# EasyEDA Pro project TJMakes_Hub.eprj

# Schematic schematic1
Create Date: 2024-02-23; Page Name: P1; Project Name: TJMakes_Hub; Schematic Name: schematic1; Update Date: 2024-02-26; Company: EasyEDA.com; Drawn: EasyEDA; Page Size: A4; Part Number: JLCPCB-002; Reviewed: EasyEDA; Version: V0.1
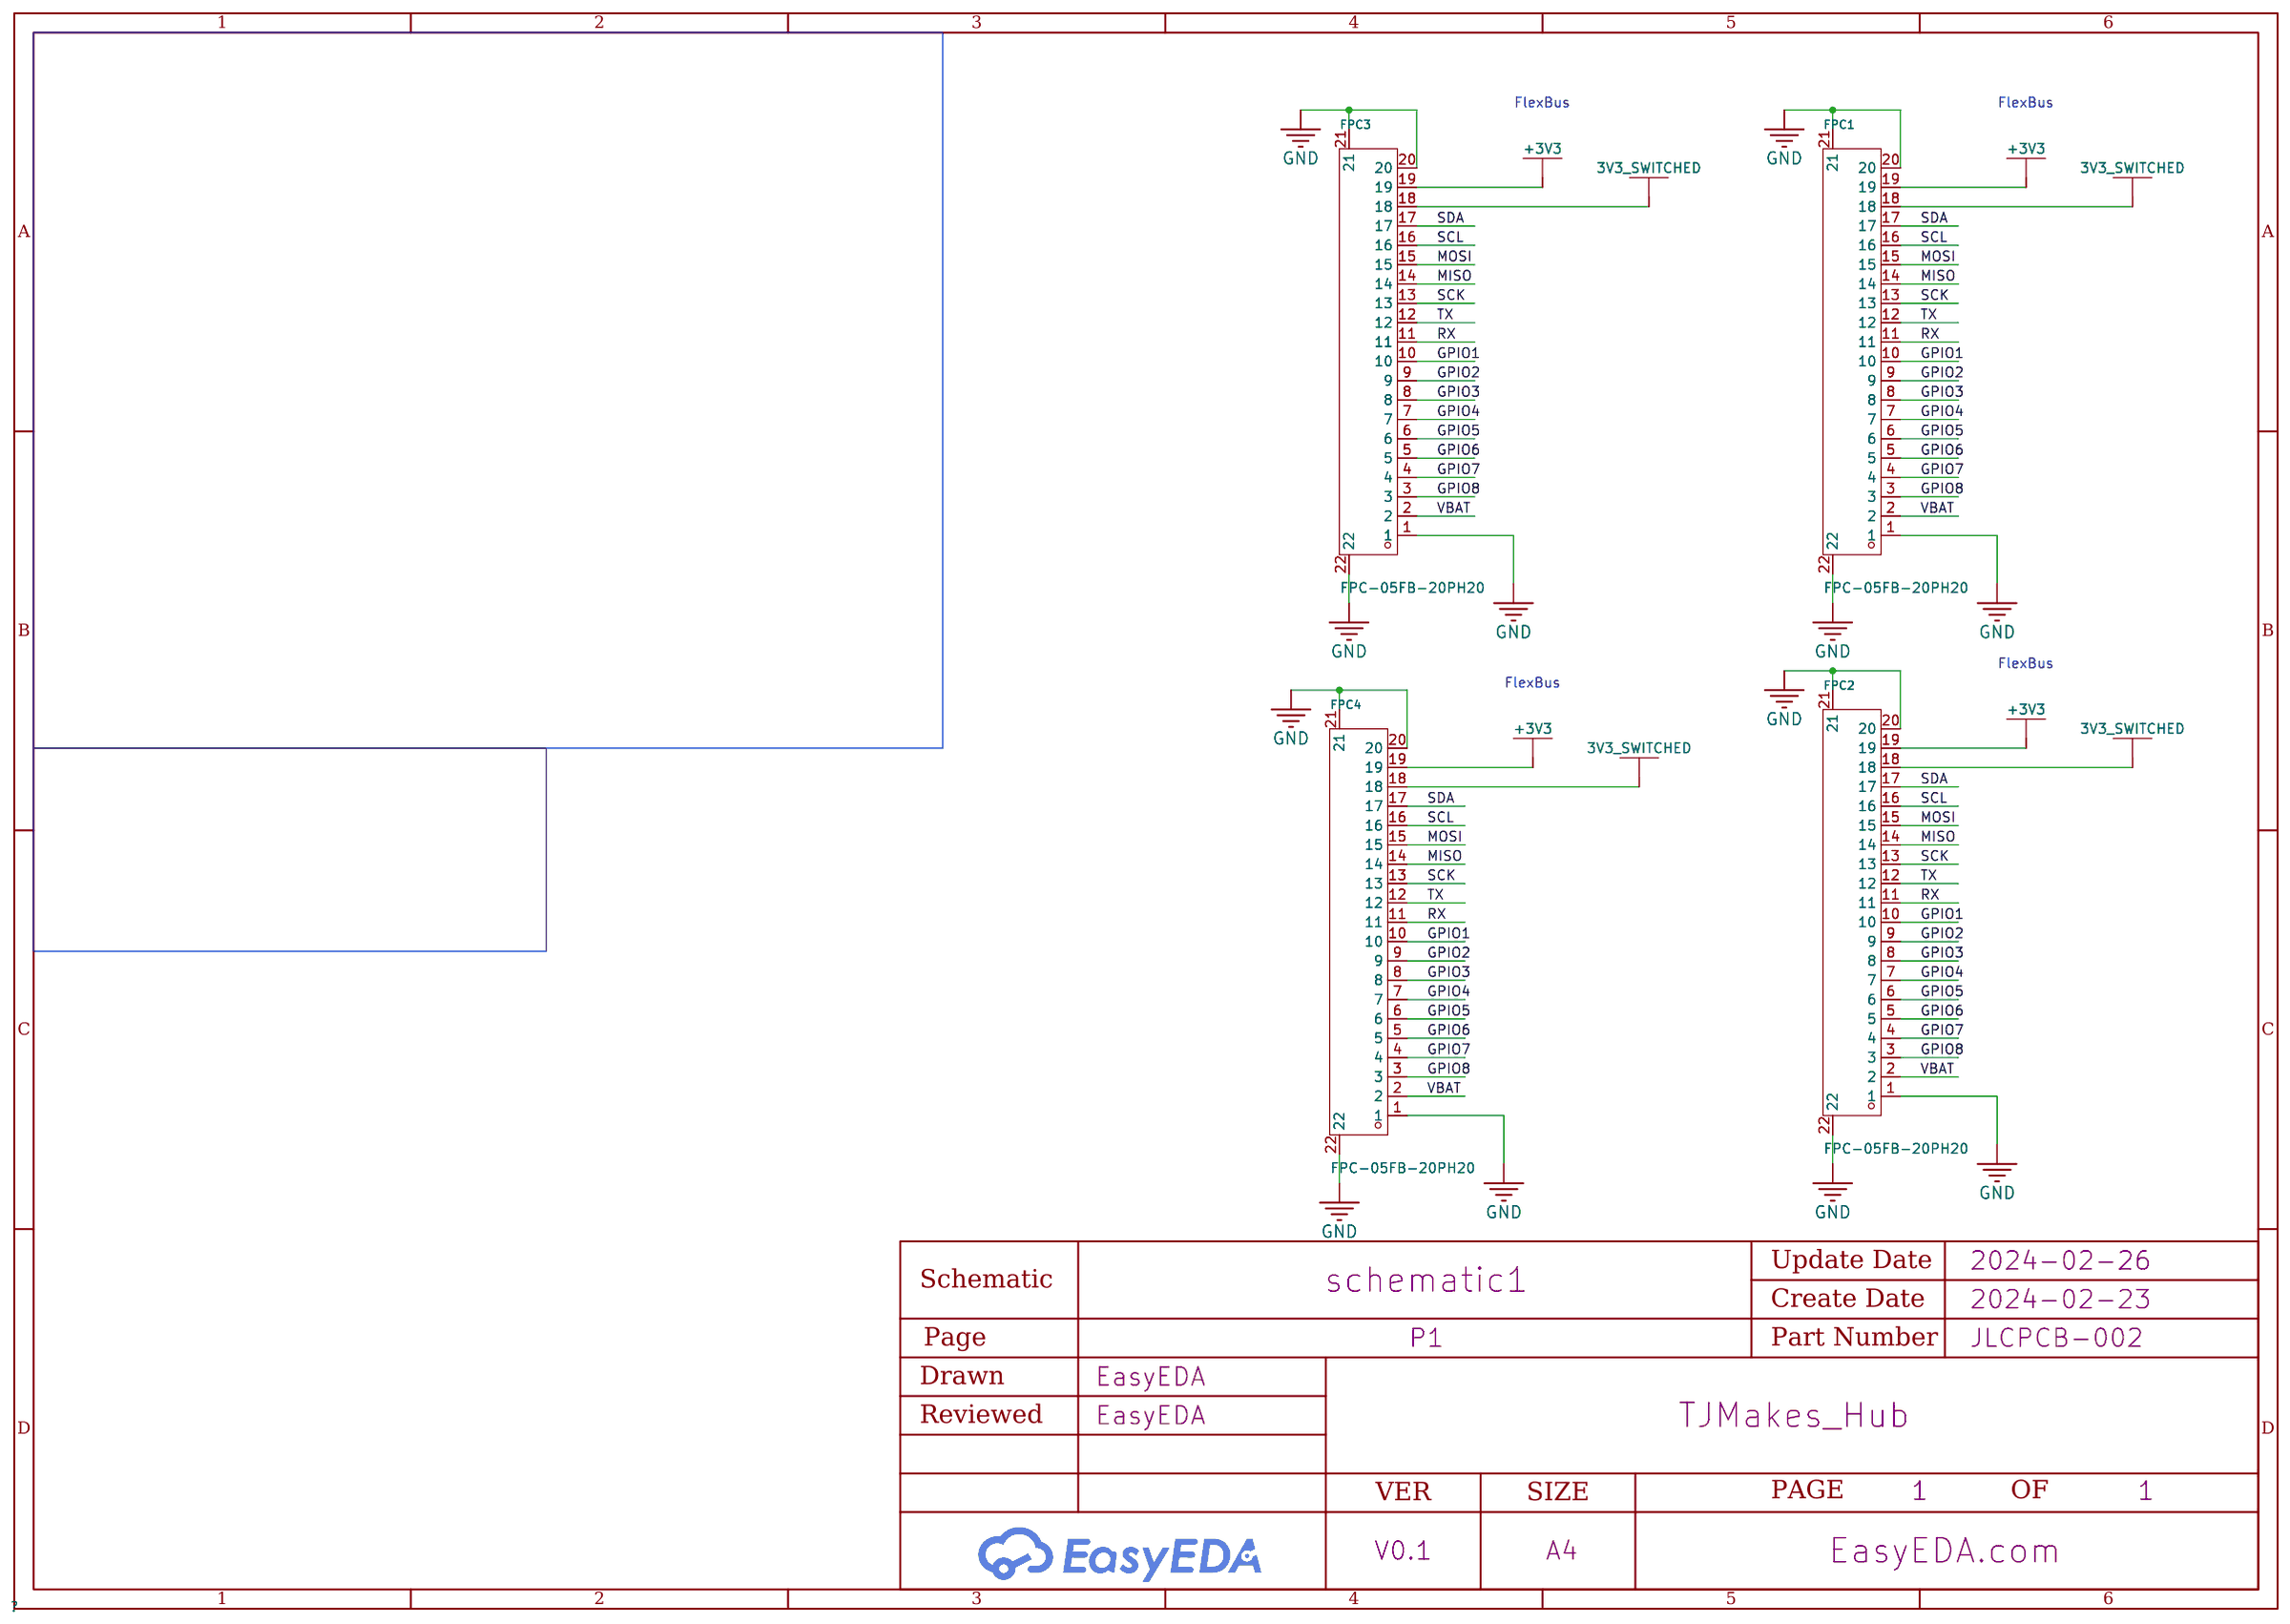
[diagram p0: schematic sheet]

## Parts
FPC1  FPC-05FB-20PH20  [FPC-SMD_20P-P0.50_FPC-05FB-20PH20]
FPC2  FPC-05FB-20PH20  [FPC-SMD_20P-P0.50_FPC-05FB-20PH20]
FPC3  FPC-05FB-20PH20  [FPC-SMD_20P-P0.50_FPC-05FB-20PH20]
FPC4  FPC-05FB-20PH20  [FPC-SMD_20P-P0.50_FPC-05FB-20PH20]

## Library data of the parts
FPC1-FPC4 = FPC-05FB-20PH20: Pitch:0.5mm Number of Contacts:20P Locking Feature:Clamshell FFC, FCB Thickness:0.3mm FFC, FCB Thickness:0.3mm Contact Type:Double-sided contacts/up and down connection Mounting Type:Surface Mount Height Above Board:2mm Operating Temperature Range:-25℃~+8; LCSC Part Name: 间距:0.5mm P数:20P 翻盖式 双侧触点/上下接; Supplier Part: C2856830; Manufacturer: XUNPU(讯普); Supplier Footprint: SMD,P=0.5mm,卧贴; JLCPCB Part Class: Extended Part; Datasheet: https://atta.szlcsc.com/upload/public/pdf/source/20210922/C2856830_32DC95BE77527398880E7D75F765EF2A.pdf; Supplier: LCSC; Pitch: 0.5mm; Number of Contacts: 20P; Locking Feature: Clamshell; FFC, FCB Thickness: 0.3mm; Contact Type: Double-sided contacts/up and down connection; Mounting Type: Surface Mount; Height Above Board: 2mm; Operating Temperature Range: -25℃~+85℃

## Nets
3V3_SWITCHED: FPC1.18 FPC2.18 FPC3.18 FPC4.18
+3V3: FPC1.19 FPC2.19 FPC3.19 FPC4.19
GND: FPC1.1 FPC1.20 FPC1.21 FPC1.22 FPC2.1 FPC2.20 FPC2.21 FPC2.22 FPC3.1 FPC3.20 FPC3.21 FPC3.22 FPC4.1 FPC4.20 FPC4.21 FPC4.22
VBAT: FPC1.2 FPC2.2 FPC3.2 FPC4.2
GPIO1: FPC1.10 FPC2.10 FPC3.10 FPC4.10
GPIO2: FPC1.9 FPC2.9 FPC3.9 FPC4.9
GPIO3: FPC1.8 FPC2.8 FPC3.8 FPC4.8
GPIO4: FPC1.7 FPC2.7 FPC3.7 FPC4.7
GPIO5: FPC1.6 FPC2.6 FPC3.6 FPC4.6
GPIO6: FPC1.5 FPC2.5 FPC3.5 FPC4.5
GPIO7: FPC1.4 FPC2.4 FPC3.4 FPC4.4
GPIO8: FPC1.3 FPC2.3 FPC3.3 FPC4.3
MISO: FPC1.14 FPC2.14 FPC3.14 FPC4.14
MOSI: FPC1.15 FPC2.15 FPC3.15 FPC4.15
RX: FPC1.11 FPC2.11 FPC3.11 FPC4.11
SCK: FPC1.13 FPC2.13 FPC3.13 FPC4.13
SCL: FPC1.16 FPC2.16 FPC3.16 FPC4.16
SDA: FPC1.17 FPC2.17 FPC3.17 FPC4.17
TX: FPC1.12 FPC2.12 FPC3.12 FPC4.12

## Notes on the sheet
- FlexBus
- FlexBus
- FlexBus
- FlexBus

# Board PCB1
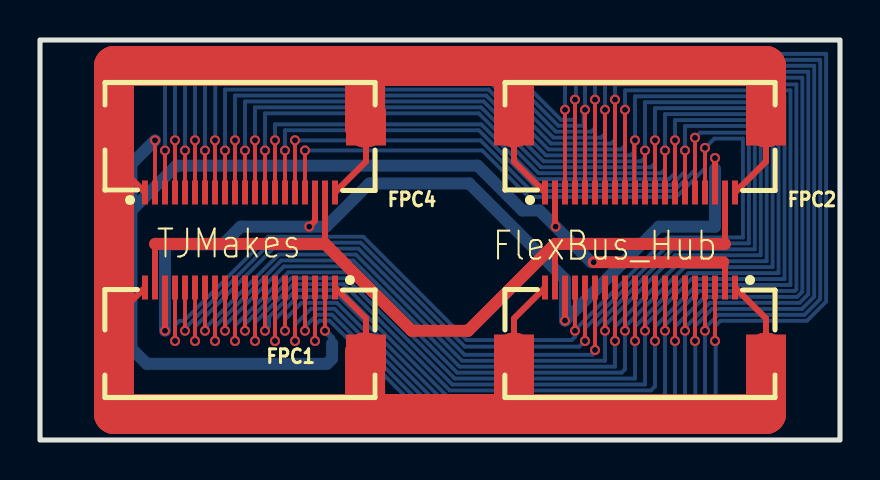
[diagram p1: board, top side]
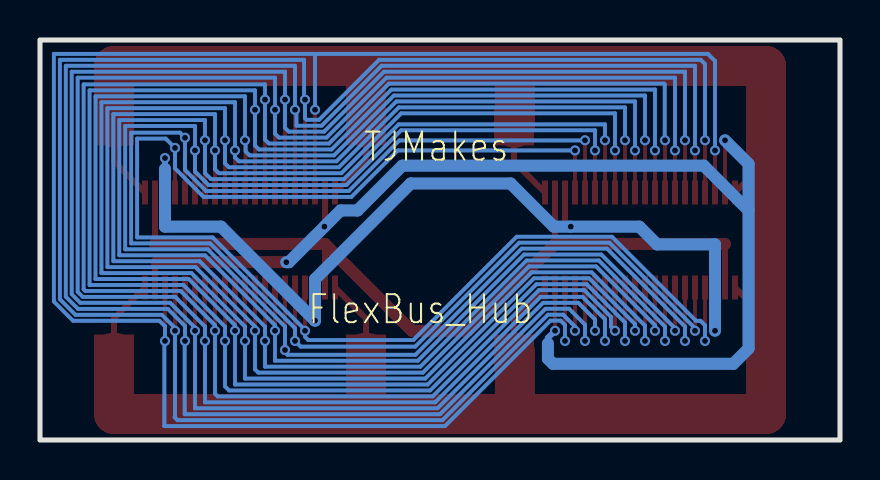
[diagram p2: board, bottom side, seen from below]

Outline 40 x 20 mm; copper layers: Top Layer, Bottom Layer. Coordinates in mm from the lower left corner of the outline.
Outline path: rectangle 0,20 40,0
Stack: Top Layer 0.035mm / Dielectric1 1.51mm FR4 er 4.5 / Bottom Layer 0.035mm

## Design rules (mm)
template: JLCPCB Capability(Two Layers Board)
spacing copperThickness1oz (default): track to track 0.102, other pairs 0.152 to 0.3
spacing copperThickness2oz: track to track 0.203, other pairs 0.152 to 0.3
track width copperThickness1oz (default): min 0.127, default 0.254, max 2.54
track width copperThickness2oz: min 0.203, default 0.254, max 2.54
differential pair differentialPair (default): width min 0.127, default 0.254, max 2.54; gap min 0.152, default 0.152
via viaSize (default): diameter min 0.5, default 0.61, max 10; hole min 0.3, default 0.305, max 6.3

## Placement (name value [footprint] x y rotation side)
FPC1  FPC-05FB-20PH20  [FPC-SMD_20P-P0.50_FPC-05FB-20PH20]  10 6 0 top
FPC2  FPC-05FB-20PH20  [FPC-SMD_20P-P0.50_FPC-05FB-20PH20]  30 14 180 top
FPC3  FPC-05FB-20PH20  [FPC-SMD_20P-P0.50_FPC-05FB-20PH20]  30 6 0 top
FPC4  FPC-05FB-20PH20  [FPC-SMD_20P-P0.50_FPC-05FB-20PH20]  10 14 180 top

## Footprints (pads in the part's own frame, mm; a bottom-side part is the same pattern mirrored in y, then rotated)
FPC-SMD_20P-P0.50_FPC-05FB-20PH20
  rect 0.3x1.2 smd: 1(4.75,1.625) 2(4.25,1.625) 3(3.75,1.625) 4(3.25,1.625) 5(2.75,1.625) 6(2.25,1.625) 7(1.75,1.625) 8(1.25,1.625) 9(0.75,1.625) 10(0.25,1.625) 11(-0.25,1.625) 12(-0.75,1.625) 13(-1.25,1.625) 14(-1.75,1.625) 15(-2.25,1.625) 16(-2.75,1.625) 17(-3.25,1.625) 18(-3.75,1.625) 19(-4.25,1.625) 20(-4.75,1.625)
  rect 2x1.8 smd: 21(-6.3,-1.625) 22(6.3,-1.625)

## Nets
As in the schematic.

## Via types
v1: diameter 0.5, hole 0.3, Top Layer to Bottom Layer, 68 vias

## Routing (per net, layer and track width the routed paths; a pad name or vN(x,y) marks a point on that pad's centre or on a via; arc(x,y) is an arc through that point)
3V3_SWITCHED: length 49.9
  Top Layer w0.3: FPC4.18 13.75,10.96 v1(13.46,10.67) ; v1(26.25,5.97) FPC3.18 ; v1(33.75,14.1) FPC2.18 ; FPC1.18 v1(6.25,5.46)
  Bottom Layer w0.3: v1(33.75,14.1) 33.75,13.56
  Bottom Layer w0.6: v1(6.25,5.46) 6.25,9.78 9.14,9.78 10.03,10.67 v1(13.46,10.67) 14.31,10.67 16.47,12.83 21.46,12.83 26.25,8.04 v1(26.25,5.97) 30.95,10.67 33.75,10.67 33.75,13.56
+3V3: length 41.6
  Top Layer w0.195: 25.75,7.72 25.78,7.75
  Top Layer w0.3: FPC2.19 34.25,9.81 ; FPC1.19 5.75,9.81 ; FPC4.19 14.25,9.81 ; 25.75,9.81 25.75,7.72
  Top Layer w0.6: 34.25,9.81 25.75,9.81 21.41,5.46 18.59,5.46 14.25,9.81 5.75,9.81
GND: length 128.9
  Top Layer w0.3: FPC3.20 23.7,6.08 FPC3.21 ; FPC2.22 23.7,13.92 FPC2.1 ; FPC1.22 16.3,6.08 FPC1.1 ; FPC2.20 36.3,13.92 FPC2.21 ; FPC4.1 3.7,13.92 ; FPC4.21 16.3,13.92 FPC4.20 ; FPC3.1 36.3,6.08 FPC3.22 ; FPC1.20 3.7,6.08
  Top Layer w2: FPC2.22 23.7,18.7 ; 23.7,18.7 36.3,18.7 FPC2.21 ; 23.7,18.7 16.26,18.7 ; 23.7,1.3 16.26,1.3 ; 23.7,1.3 36.3,1.3 FPC3.22 ; 23.7,1.3 FPC3.21 ; 16.26,1.3 16.26,4.38 FPC1.22 ; 16.26,1.3 3.7,1.3 FPC1.21 FPC4.22 3.7,18.7 16.26,18.7 ; 16.26,18.7 16.26,15.62 FPC4.21
VBAT: length 63.2
  Top Layer w0.195: FPC4.2 v1(5.75,14.99) ; FPC1.2 v1(14.25,5.46)
  Top Layer w0.3: 34.16,8.89 34.25,8.8 FPC3.2 ; v1(25.78,10.67) 25.75,10.7 FPC2.2
  Top Layer w0.6: v1(27.69,8.89) 34.16,8.89
  Bottom Layer w0.3: v1(14.25,5.46) 14.6,5.11 14.6,4.83
  Bottom Layer w0.6: 14.6,4.83 14.6,4.06 14.35,3.81 5.33,3.81 4.57,4.57 4.57,11.48 ; 4.57,11.48 4.57,13.81 v1(5.75,14.99) ; 4.57,11.48 6.81,13.72 21.88,13.72 24.12,11.48 24.97,11.48 v1(25.78,10.67) 27.56,8.89 v1(27.69,8.89)
GPIO1: length 86.8
  Top Layer w0.195: FPC1.10 v1(10.25,5.46) ; FPC2.10 29.72,12.41 29.72,14.99 ; FPC4.10 v1(9.75,14.99) ; FPC3.10 v1(30.25,5.46)
  Bottom Layer w0.195: v1(9.75,14.99) 9.75,17.23 22.31,17.23 25.3,14.23 29.52,14.23 29.72,14.43 29.72,14.99 ; v1(10.25,5.46) 10.25,5.8 12.54,8.09 15.3,8.09 20.61,2.77 30.25,2.77 v1(30.25,5.46) 30.25,5.74 32.56,8.05 37.22,8.05 37.22,17.19 29.75,17.19 v1(29.75,14.99)
GPIO2: length 91.4
  Top Layer w0.195: FPC1.9 v1(10.75,4.95) ; FPC3.9 v1(30.75,4.95) ; FPC2.9 v1(29.25,16.51) ; FPC4.9 v1(9.25,14.48)
  Bottom Layer w0.195: v1(10.75,4.95) 10.75,5.88 12.66,7.79 15.18,7.79 20.49,2.48 30.54,2.48 30.75,2.68 v1(30.75,4.95) 30.75,5.67 32.83,7.75 37.52,7.75 37.52,17.48 29.25,17.48 v1(29.25,16.51) 29.25,14.72 29.06,14.53 25.42,14.53 22.43,17.52 9.25,17.52 v1(9.25,14.48) 9.27,14.48
GPIO3: length 91.9
  Top Layer w0.195: FPC3.8 v1(31.25,5.46) ; FPC2.8 v1(28.75,17.02) ; FPC4.8 v1(8.75,14.99) ; FPC1.8 v1(11.25,5.46)
  Bottom Layer w0.195: v1(31.25,5.46) 31.25,5.74 32.97,7.45 37.74,7.45 37.82,7.53 37.82,17.78 28.75,17.78 v1(28.75,17.02) 28.75,15.02 28.56,14.82 25.55,14.82 22.55,17.82 8.8,17.82 8.76,17.78 8.76,15 v1(8.75,14.99) ; v1(31.25,5.46) 31.24,5.46 ; v1(31.25,5.46) 31.25,2.31 31.12,2.18 20.37,2.18 15.05,7.49 12.79,7.49 11.45,6.16 11.45,5.66 v1(11.25,5.46)
GPIO4: length 94.5
  Top Layer w0.195: FPC2.7 v1(28.25,16.51) ; FPC1.7 v1(11.75,4.95) ; FPC4.7 v1(8.25,14.48) ; FPC3.7 v1(31.75,4.95)
  Bottom Layer w0.195: 8.25,14.48 v1(8.25,14.48) 8.25,18.12 22.68,18.12 25.67,15.12 28.06,15.12 28.25,15.32 v1(28.25,16.51) 28.25,18.12 38.12,18.12 38.12,7.41 37.86,7.16 33.24,7.16 31.75,5.67 v1(31.75,4.95) 31.75,1.88 20.24,1.88 14.97,7.16 12.87,7.16 11.75,6.03 v1(11.75,4.95)
GPIO5: length 94.9
  Top Layer w0.195: FPC1.6 v1(12.25,5.46) ; FPC2.6 v1(27.75,17.02) ; FPC3.6 v1(32.25,5.46) ; FPC4.6 v1(7.75,14.99)
  Bottom Layer w0.195: v1(12.25,5.46) 12.25,6.03 13.08,6.86 14.85,6.86 20.12,1.59 32.25,1.59 v1(32.25,5.46) 32.25,5.62 33.49,6.86 37.99,6.86 38.41,7.29 38.41,18.41 27.75,18.41 v1(27.75,17.02) 27.75,15.61 27.56,15.42 25.8,15.42 22.8,18.41 7.75,18.41 v1(7.75,14.99)
GPIO6: length 97.4
  Top Layer w0.195: FPC4.5 v1(7.25,14.48) ; FPC3.5 v1(32.75,4.95) ; FPC2.5 v1(27.25,16.51) ; FPC1.5 v1(12.75,4.95)
  Bottom Layer w0.195: v1(7.25,14.48) 7.25,18.71 22.92,18.71 25.92,15.71 27.18,15.71 27.18,16.44 v1(27.25,16.51) 27.25,18.71 38.71,18.71 38.71,7.17 38.1,6.56 33.61,6.56 32.75,5.7 v1(32.75,4.95) 32.77,4.95 32.77,1.29 20,1.29 14.72,6.56 13.55,6.56 12.75,5.77 v1(12.75,4.95)
GPIO7: length 97.4
  Top Layer w0.195: FPC3.4 v1(33.25,5.46) ; FPC4.4 v1(6.75,14.99) ; v1(13.25,5.46) FPC1.4 ; FPC2.4 v1(26.75,17.02)
  Bottom Layer w0.195: 33.25,1.12 v1(33.25,5.46) 33.25,5.6 33.91,6.26 38.22,6.26 39.01,7.04 39.01,19.01 26.8,19.01 26.8,17.06 v1(26.75,17.02) 26.75,16.09 26.67,16.01 26.04,16.01 23.04,19.01 6.96,19.01 6.75,18.8 v1(6.75,14.99) ; 33.25,1.12 33.12,0.99 19.88,0.99 14.6,6.27 13.85,6.27 13.25,5.67 v1(13.25,5.46) ; 33.25,1.12 33.27,1.14
GPIO8: length 98.6
  Top Layer w0.195: FPC1.3 v1(13.75,4.95) ; 33.78,4.95 33.75,4.98 FPC3.3 ; FPC2.3 v1(26.25,16.51) ; FPC4.3 v1(6.25,14.48)
  Bottom Layer w0.195: v1(13.75,4.95) 13.75,5.75 13.97,5.97 14.48,5.97 19.75,0.69 33.78,0.69 33.78,4.92 v1(33.75,4.95) 33.75,5.68 34.03,5.96 38.35,5.96 39.31,6.92 39.31,19.31 26.29,19.31 26.25,19.27 26.25,19.22 ; 26.25,19.22 v1(26.25,16.51) ; 26.25,19.22 26.16,19.31 6.61,19.31 6.25,18.95 v1(6.25,14.48)
MISO: length 80.2
  Top Layer w0.195: FPC3.14 v1(28.25,5.46) ; FPC1.14 v1(8.25,5.46) ; FPC2.14 v1(31.75,14.99) ; FPC4.14 v1(11.75,14.99)
  Bottom Layer w0.195: v1(11.75,14.99) 11.75,15.78 22.07,15.78 24.81,13.04 31.45,13.04 31.75,13.34 v1(31.75,14.99) 31.75,16 36.04,16 36.04,9.24 31.75,9.24 28.25,5.74 v1(28.25,5.46) 28.25,3.96 21.1,3.96 15.79,9.27 11.94,9.27 8.25,5.59 v1(8.25,5.46)
MOSI: length 80
  Top Layer w0.195: FPC3.15 27.75,4.51 27.81,4.44 ; FPC1.15 v1(7.75,4.95) ; FPC4.15 v1(12.25,14.48) ; FPC2.15 v1(32.25,14.48)
  Bottom Layer w0.195: 27.81,4.44 27.63,4.26 21.23,4.26 15.92,9.57 11.65,9.57 7.75,5.67 v1(7.75,4.95) ; 27.75,4.44 27.75,5.67 31.62,9.53 35.74,9.53 35.74,15.7 32.25,15.7 v1(32.25,14.48) 32.25,13.42 31.57,12.75 24.68,12.75 21.94,15.49 12.25,15.49 v1(12.25,14.48) 12.32,14.48
  vias: v1(27.75,4.5)
RX: length 86.3
  Top Layer w0.195: FPC2.11 v1(30.25,14.48) ; FPC1.11 v1(9.75,4.95) ; FPC3.11 v1(29.75,4.95) ; FPC4.11 v1(10.25,14.48)
  Bottom Layer w0.195: v1(9.75,4.95) 9.75,5.71 12.42,8.38 15.42,8.38 20.74,3.07 29.75,3.07 v1(29.75,4.95) 29.75,5.67 32.43,8.35 36.93,8.35 36.93,16.89 30.25,16.89 v1(30.25,14.48) 30.25,14.13 30.06,13.93 25.18,13.93 22.18,16.93 10.25,16.93 v1(10.25,14.48) 10.16,14.48
SCK: length 83.2
  Top Layer w0.195: FPC2.13 v1(31.25,14.48) ; FPC4.13 v1(11.25,14.48) ; 8.76,4.95 8.75,4.97 FPC1.13 ; FPC3.13 v1(28.75,4.95)
  Bottom Layer w0.195: v1(31.25,14.48) 31.24,14.48 ; v1(31.25,14.48) 31.25,16.29 36.33,16.29 36.33,8.94 32.02,8.94 28.75,5.67 v1(28.75,4.95) ; v1(31.25,14.48) 31.25,13.54 31.06,13.34 24.93,13.34 21.94,16.33 11.25,16.33 v1(11.25,14.48) ; v1(28.75,4.95) 28.75,3.67 20.98,3.67 15.67,8.98 12.06,8.98 8.75,5.67 v1(8.75,4.95) ; v1(28.75,4.95) 28.83,4.95
SCL: length 76.4
  Top Layer w0.195: FPC4.16 v1(12.75,14.99) ; FPC1.16 v1(7.25,5.46) ; v1(27.25,4.95) FPC3.16 ; v1(32.75,15.11) FPC2.16
  Bottom Layer w0.195: v1(7.25,5.46) 7.25,5.59 11.53,9.87 16.04,9.87 21.24,4.67 26.97,4.67 v1(27.25,4.95) 27.25,5.59 31.49,9.83 35.44,9.83 35.44,15.37 33,15.37 v1(32.75,15.11) 32.75,13.5 31.7,12.45 24.56,12.45 22.03,14.98 12.76,14.98 v1(12.75,14.99) 12.7,14.99
SDA: length 74.4
  Top Layer w0.195: v1(33.25,14.61) FPC2.17 ; v1(26.75,5.46) 26.75,7.7 26.8,7.75 ; FPC1.17 v1(6.75,4.95) ; FPC4.17 v1(13.25,14.48)
  Bottom Layer w0.195: v1(13.25,14.48) 22.11,14.48 24.44,12.15 31.82,12.15 33.25,13.58 v1(33.25,14.61) 33.72,15.07 35.15,15.07 35.15,10.13 31.37,10.13 26.75,5.51 v1(26.75,5.46) 26.75,5.16 26.59,5 21.33,5 16.16,10.16 11.41,10.16 7.2,5.96 6.97,5.96 6.75,5.73 v1(6.75,4.95)
TX: length 83.7
  Top Layer w0.195: FPC2.12 v1(30.75,14.99) ; FPC1.12 v1(9.25,5.46) ; FPC4.12 v1(10.75,14.99) ; FPC3.12 v1(29.25,5.46)
  Bottom Layer w0.195: v1(30.75,14.99) 30.75,13.83 30.56,13.64 25.05,13.64 22.06,16.63 10.75,16.63 v1(10.75,14.99) 10.67,14.99 ; v1(30.75,14.99) 30.73,14.99 ; v1(30.75,14.99) 30.75,16.59 36.63,16.59 36.63,8.64 32.23,8.64 29.25,5.67 v1(29.25,5.46) 29.25,3.53 29.08,3.37 20.86,3.37 15.55,8.68 12.19,8.68 9.25,5.74 v1(9.25,5.46)

## Text on the board
Bottom Silkscreen Layer: TJMakes | FlexBus_Hub
Top Silkscreen Layer: TJMakes | FlexBus_Hub
